# Altium schematic sheet Sensors.SchDoc
size A4; SheetNumber: 2; SheetTotal: 3
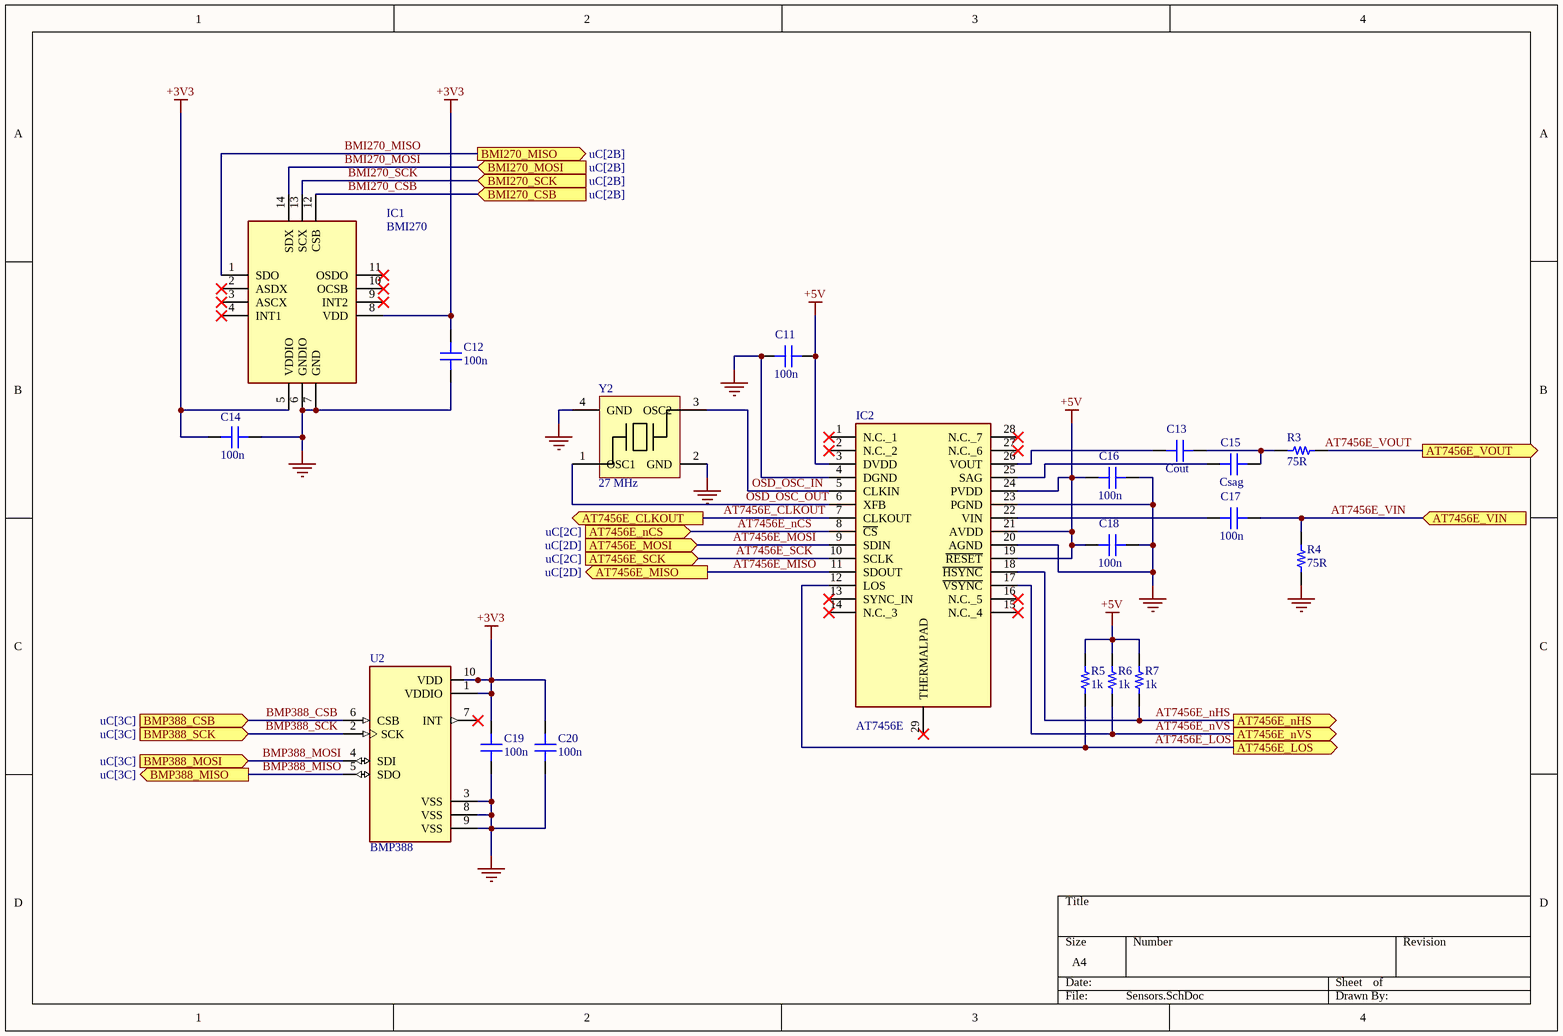
[diagram p0: Sensors.SchDoc]

## Parts
C11  Capacitance: 100n  [CAP 0603_1608]  (hidden comment: 0.1 µF)
C12  Capacitance: 100n  [CAP 0603_1608]  (hidden comment: 0.1 µF)
C13  Capacitance: Cout  [CAP 0603_1608]  (hidden comment: 0.1 µF)
C14  Capacitance: 100n  [CAP 0603_1608]  (hidden comment: 0.1 µF)
C15  Capacitance: Csag  [CAP 0603_1608]  (hidden comment: 0.1 µF)
C16  Capacitance: 100n  [CAP 0603_1608]  (hidden comment: 0.1 µF)
C17  Capacitance: 100n  [CAP 0603_1608]  (hidden comment: 0.1 µF)
C18  Capacitance: 100n  [CAP 0603_1608]  (hidden comment: 0.1 µF)
C19  Capacitance: 100n  [CAP 0603_1608]  (hidden comment: 0.1 µF)
C20  Capacitance: 100n  [CAP 0603_1608]  (hidden comment: 0.1 µF)
IC1  BMI270  [BMI270]
IC2  AT7456E  [SOP65P640X120-29N]
R3  75R  [YAGEO RES 0603_1608]
R4  75R  [YAGEO RES 0603_1608]
R5  1k  [YAGEO RES 0603_1608]
R6  1k  [YAGEO RES 0603_1608]
R7  1k  [YAGEO RES 0603_1608]
U2  BMP388  [PQFN50P200X200X80-10N]
Y2  27 MHz  [X322527MSB4SI]

## Ports
AT7456E_CLKOUT (out), AT7456E_LOS (out), AT7456E_MISO (out, see uC[2D]), AT7456E_MOSI (in, see uC[2D]), AT7456E_nCS (in, see uC[2C]), AT7456E_nHS (out), AT7456E_nVS (out), AT7456E_SCK (in, see uC[2C]), AT7456E_VIN (in), AT7456E_VOUT (out), BMI270_CSB (in, see uC[2B]), BMI270_MISO (out, see uC[2B]), BMI270_MOSI (in, see uC[2B]), BMI270_SCK (in, see uC[2B]), BMP388_CSB (in, see uC[3C]), BMP388_MISO (out, see uC[3C]), BMP388_MOSI (in, see uC[3C]), BMP388_SCK (in, see uC[3C])

## Nets
+3V3: C12.1 C14.2 C19.1 C20.1 IC1.5(VDDIO) IC1.8(VDD) U2.1(VDDIO) U2.10(VDD)
+5V: C11.2 C16.1 C18.1 IC2.3(DVDD) IC2.19(~{RESET}) IC2.21(AVDD) IC2.24(PVDD) R5.2 R6.2 R7.2
GND: C11.1 C12.2 C14.1 C16.2 C18.2 C19.2 C20.2 IC1.6(GNDIO) IC1.7(GND) IC2.4(DGND) IC2.20(AGND) IC2.23(PGND) R4.2 U2.3(VSS) U2.8(VSS) U2.9(VSS) Y2.2(GND) Y2.4(GND)
AT7456E_CLKOUT: IC2.7(CLKOUT) ; port AT7456E_CLKOUT
AT7456E_LOS: IC2.12(LOS) R5.1 ; port AT7456E_LOS
AT7456E_MISO: IC2.11(SDOUT) ; port AT7456E_MISO
AT7456E_MOSI: IC2.9(SDIN) ; port AT7456E_MOSI
AT7456E_nCS: IC2.8(~{CS}) ; port AT7456E_nCS
AT7456E_nHS: IC2.18(~{HSYNC}) R7.1 ; port AT7456E_nHS
AT7456E_nVS: IC2.17(~{VSYNC}) R6.1 ; port AT7456E_nVS
AT7456E_SCK: IC2.10(SCLK) ; port AT7456E_SCK
AT7456E_VIN: C17.2 R4.1 ; port AT7456E_VIN
AT7456E_VOUT: R3.1 ; port AT7456E_VOUT
BMI270_CSB: IC1.12(CSB) ; port BMI270_CSB
BMI270_MISO: IC1.1(SDO) ; port BMI270_MISO
BMI270_MOSI: IC1.14(SDX) ; port BMI270_MOSI
BMI270_SCK: IC1.13(SCX) ; port BMI270_SCK
BMP388_CSB: U2.6(CSB) ; port BMP388_CSB
BMP388_MISO: U2.5(SDO) ; port BMP388_MISO
BMP388_MOSI: U2.4(SDI) ; port BMP388_MOSI
BMP388_SCK: U2.2(SCK) ; port BMP388_SCK
OSD_OSC_IN: IC2.5(CLKIN) Y2.3(OSC2)
OSD_OSC_OUT: IC2.6(XFB) Y2.1(OSC1)
NetC13_1: C13.1 IC2.26(VOUT)
NetC13_2: C13.2 C15.2 R3.2
NetC15_1: C15.1 IC2.25(SAG)
NetC17_1: C17.1 IC2.22(VIN)

Not connected (* = marked no-connect by the designer): IC1 2(ASDX)* 3(ASCX)* 4(INT1)* 9(INT2)* 10(OCSB)* 11(OSDO)*; IC2 1(N.C._1)* 2(N.C._2)* 13(SYNC_IN)* 14(N.C._3)* 15(N.C._4)* 16(N.C._5)* 27(N.C._6)* 28(N.C._7)* 29(THERMALPAD)*; U2 7(INT)*

## Library data of the parts
C11-C20 = CL10B104KB8NNNC: CAP CER 0.1UF 50V X7R 0603; manufacturer: Samsung Electro-Mechanics; Tolerance: ±10%; Part Number: CL10B104KB8NNNC; Applications: General Purpose; componentlink1description: Datasheet; componentlink1url: http://www.samsungsem.com/kr/support/product-search/mlcc/CL10B104KB8NNNC.jsp; componentlink2description: DigiKey Link; componentlink2url: https://www.digikey.com/en/products/detail/samsung-electro-mechanics/CL10B104KB8NNNC/3886658; Device Package: 0603 (1608 Metric); lastupdated: 09/02/2024 20:10:20; Lifecycle Status: Active; Minimum Order: 1; Mounting Type: Surface Mount, MLCC; Operating Temperature: -55°C ~ 125°C; Package / Case: 0603 (1608 Metric); packaging: TapeAndReel; partid: 9788; Part Status: Active; price: 0.01; series: CL; Size / Dimension: 0.063" L x 0.031" W (1.60mm x 0.80mm); Supplier 1: DigiKey; Supplier Part Number 1: 1276-1000-1-ND; Temperature Coefficient: X7R; Thickness (Max): 0.035" (0.90mm); value: 0.1 µF; Voltage - Rated: 50V
IC1 = BMI270: Integrated Circuit; Manufacturer_Name: BOSCH; Datasheet Link: https://www.bosch-sensortec.com/media/boschsensortec/downloads/datasheets/bst-bmi270-ds000.pdf; Height: 0.87mm; Manufacturer_Part_Number: BMI270; Mouser Part Number: 262-BMI270; Mouser Price/Stock: https://www.mouser.co.uk/ProductDetail/Bosch-Sensortec/BMI270?qs=u16ybLDytRYIj%252BjQEee88A%3D%3D; Arrow Part Number: BMI270; Arrow Price/Stock: https://www.arrow.com/en/products/bmi270/bosch?utm_currency=USD&region=nac
IC2 = AT7456E: Integrated Circuit; Manufacturer_Name: ICOF; Datasheet Link: https://datasheet.lcsc.com/szlcsc/ZHONGKEWEI-AT7456E_C82351.pdf; Height: 1.2mm; Manufacturer_Part_Number: AT7456E
R3 R4 = RC0603FR-0775RL: RES 75 OHM 1% 1/10W 0603; Manufacturer: Yageo; Power (Watts): 0.1W, 1/10W; Resistance: 75 Ohms; Temperature Coefficient: ±100ppm/°C; Part Number: RC0603FR-0775RL; Value: 75R; ComponentLink1Description: Datasheet; ComponentLink1URL: https://www.yageo.com/upload/media/product/productsearch/datasheet/rchip/PYu-RC_Group_51_RoHS_L_10.pdf; ComponentLink2Description: DigiKey Link; ComponentLink2URL: https://www.digikey.com/en/products/detail/yageo/RC0603FR-0775RL/727377; Composition: Thick Film; Device Package: 0603 (1608 Metric); Features: Moisture Resistant; Height - Seated (Max): 0.022" (0.55mm); LastUpdated: 25/07/2024 09:19:21; Lifecycle Status: Active; Minimum Order: 1; Number of Terminations: 2; Operating Temperature: -55°C ~ 155°C; Package / Case: 0603 (1608 Metric); Packaging: CutTape; PartId: 18934; Part Status: Active; Price: 0.01; Series: RC_L; Size / Dimension: 0.063" L x 0.031" W (1.60mm x 0.80mm); Supplier 1: DigiKey; Supplier Part Number 1: 311-75.0HRCT-ND; Supplier Device Package: 0603; Tolerance: ±1%
R5-R7 = RC0603FR-071KL: RES 1K OHM 1% 1/10W 0603; Manufacturer: Yageo; Power (Watts): 0.1W, 1/10W; Resistance: 1 kOhms; Temperature Coefficient: ±100ppm/°C; Part Number: RC0603FR-071KL; Value: 1k; ComponentLink1Description: Datasheet; ComponentLink1URL: https://www.yageo.com/upload/media/product/productsearch/datasheet/rchip/PYu-RC_Group_51_RoHS_L_10.pdf; ComponentLink2Description: DigiKey Link; ComponentLink2URL: https://www.digikey.com/en/products/detail/yageo/RC0603FR-071KL/726843; Composition: Thick Film; Device Package: 0603 (1608 Metric); Features: Moisture Resistant; Height - Seated (Max): 0.022" (0.55mm); LastUpdated: 25/07/2024 09:19:19; Lifecycle Status: Active; Minimum Order: 1; Number of Terminations: 2; Operating Temperature: -55°C ~ 155°C; Package / Case: 0603 (1608 Metric); Packaging: CutTape; PartId: 22600; Part Status: Active; Price: 0.01; Series: RC_L; Size / Dimension: 0.063" L x 0.031" W (1.60mm x 0.80mm); Supplier 1: DigiKey; Supplier Part Number 1: 311-1.00KHRCT-ND; Supplier Device Package: 0603; Tolerance: ±1%
U2 = BMP388: P-Sensor SPI I2C 1, 25 Bar SMD; Package: None; Price: None; Value: *; MP: BMP388; Availability: Unavailable
Y2 = X322527MSB4SI